# Altium schematic sheet [10] Ethernet.SchDoc: 100/1000M Ethernet interface
size A4; Engineer: M. Folejewski; DocumentNumber: 10; SheetNumber: 10; SheetTotal: 15; PageSize: A4; Designators: 500-599
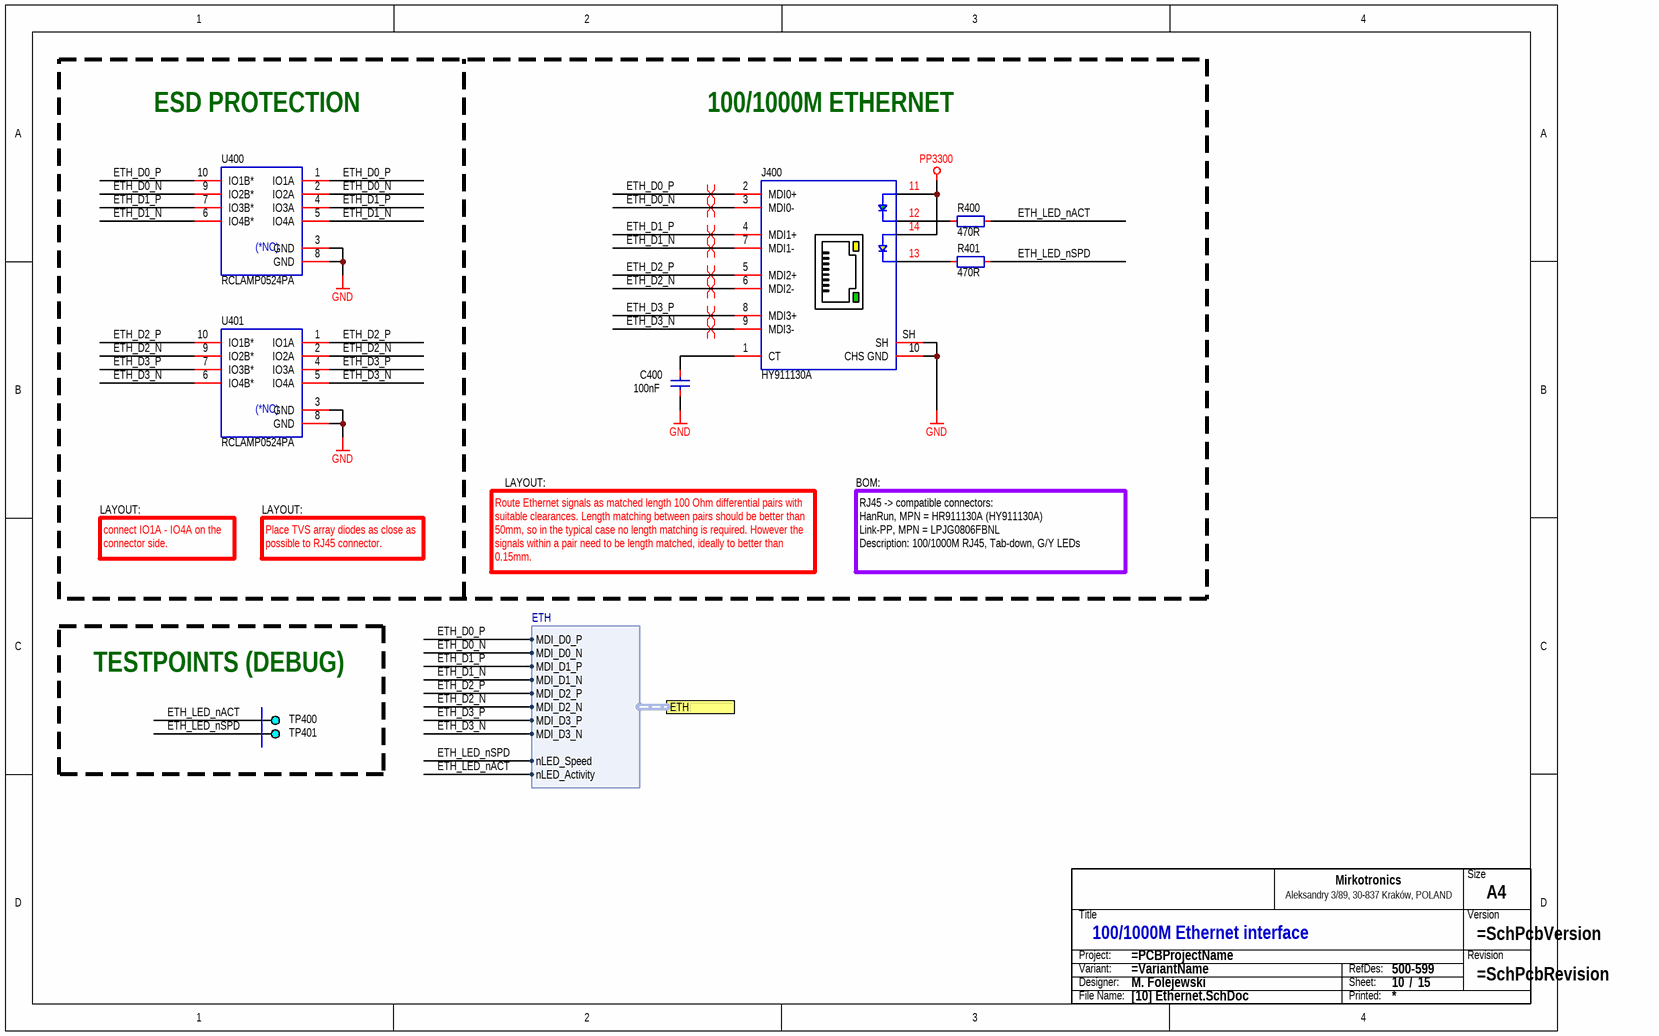
[diagram p0: [10] Ethernet.SchDoc]

## Parts
C400  100nF  [CAP_0603_R]
J400  HY911130A  [CON_WRT_7499110122]
R400  470R  [RES_0603_R]
R401  470R  [RES_0603_R]
TB?  Title block  (value not drawn)  (graphical)
TP400  DEBUG  [PCB_TP_DBG_50]  (value not drawn)  (no BOM)
TP401  DEBUG  [PCB_TP_DBG_50]  (value not drawn)  (no BOM)
U400  RCLAMP0524PA  [ICC_SLP2510P8_250X100X60_P50_R]
U401  RCLAMP0524PA  [ICC_SLP2510P8_250X100X60_P50_R]

## Ports
ETH (harness ETH)

## Harnesses
ETH: MDI_D0_P, MDI_D0_N, MDI_D1_P, MDI_D1_N, MDI_D2_P, MDI_D2_N, MDI_D3_P, MDI_D3_N, nLED_Speed, nLED_Activity

## Nets
GND: C400.1 J400.10(CHS_GND) J400.SH U400.3(GND) U400.8(GND) U401.3(GND) U401.8(GND)
PP3300: J400.11 J400.14
ETH_D0_N: J400.3(MDI0-) U400.2(IO2A) U400.9(IO2B*) ; port ETH.MDI_D0_N
ETH_D0_P: J400.2(MDI0+) U400.1(IO1A) U400.10(IO1B*) ; port ETH.MDI_D0_P
ETH_D1_N: J400.7(MDI1-) U400.5(IO4A) U400.6(IO4B*) ; port ETH.MDI_D1_N
ETH_D1_P: J400.4(MDI1+) U400.4(IO3A) U400.7(IO3B*) ; port ETH.MDI_D1_P
ETH_D2_N: J400.6(MDI2-) U401.2(IO2A) U401.9(IO2B*) ; port ETH.MDI_D2_N
ETH_D2_P: J400.5(MDI2+) U401.1(IO1A) U401.10(IO1B*) ; port ETH.MDI_D2_P
ETH_D3_N: J400.9(MDI3-) U401.5(IO4A) U401.6(IO4B*) ; port ETH.MDI_D3_N
ETH_D3_P: J400.8(MDI3+) U401.4(IO3A) U401.7(IO3B*) ; port ETH.MDI_D3_P
ETH_LED_nACT: R400.1 TP400.1 ; port ETH.nLED_Activity
ETH_LED_nSPD: R401.1 TP401.1 ; port ETH.nLED_Speed
NetC400_2: C400.2 J400.1(CT)
NetJ400_12: J400.12 R400.2
NetJ400_13: J400.13 R401.2

## Layout directives
differential pair: ETH_D0_N, ETH_D0_P, ETH_D1_N, ETH_D1_P, ETH_D2_N, ETH_D2_P, ETH_D3_N, ETH_D3_P

## Notes on the sheet
- ESD PROTECTION
- 100/1000M ETHERNET
- LAYOUT:
- BOM:
- connect IO1A - IO4A on the connector side.
- Place TVS array diodes as close as possible to RJ45 connector.
- Route Ethernet signals as matched length 100 Ohm differential pairs with suitable clearances. Length matching between pairs should be better than 50mm, so in the typical case no length matching is required. However the signals within a pair need to be length matched, ideally to better than 0.15mm.
- RJ45 -> compatible connectors:
  HanRun, MPN = HR911130A (HY911130A)
  Link-PP, MPN = LPJG0806FBNL
  Description: 100/1000M RJ45, Tab-down, G/Y LEDs
- TESTPOINTS (DEBUG)
- (in symbol ICC-0005) (*NC)
- (in symbol SCH_TITLE_BLOCK_MIRKOTRONICS_V2) Size; Mirkotronics; Aleksandry 3/89, 30-837 Kraków, POLAND; Title; Version; Project:; Revision; Variant:; RefDes:; Designer:; Sheet:; /; File Name:; Printed:

## Library data of the parts
C400 = CAP-0008: Capacitor; MLCC; 100nF; TBD; TBD; TBD; TBD; SMD; 0603 (1608);; Component Type: Capacitor; Component Subtype: MLCC; Value: 100nF; Manufacturer: TBD; MPN: TBD; Mounting Type: SMD; Package (Case): 0603 (1608); Supplier: ?
J400 = CON_HAN_HY911130A: Connector; RJ45;; Manufacturer: HanRun; MPN: HY911130A; Value: HY911130A; Component Subtype: RJ45; Component Type: Connector; Mounting Type: THT; Supplier: ?
R400 R401 = RES-0042: Resistor; Thick Film; 470R; 1%; 100mW; 100PPM; 75V; Standard; SMD; 0603 (1608);; Manufacturer: Yageo Corporation; MPN: TBD; Component Type: Resistor; Component Subtype: Thick Film; Value: 470R; Mounting Type: SMD; Package (Case): 0603 (1608); Supplier: ?
TB? = SCH_TITLE_BLOCK_MIRKOTRONICS_V2: Component Type: Title block; Manufacturer: -; Mounting Type: Non component; MPN: -; Operating Temperature: -; Package: -; Specification: Title block; Value: Title block; Replacement: -; System: ?
TP400 TP401 = PCB_TP_DBG: PCB Marking; Test Point (Debug);; Value: DEBUG; Component Subtype: -; Component Type: Testpoint; Mounting Type: -; Supplier: ?
U400 U401 = ICC-0005: IC; TVS Arrays; ESD Protection; 4-Channel; 17kV Air; 12kV Contact; 0.3pF Capitance; TBD; SMD; TBD;; Manufacturer: Semtech Corporation; MPN: RCLAMP0524PATCT; Component Type: IC; Component Subtype: TVS Arrays; Value: RCLAMP0524PA; Mounting Type: SMD; Package (Case): TBD; Supplier: ?